# EAGLE schematic IOB-Adapter-Generic (EAGLE 7.7.0)
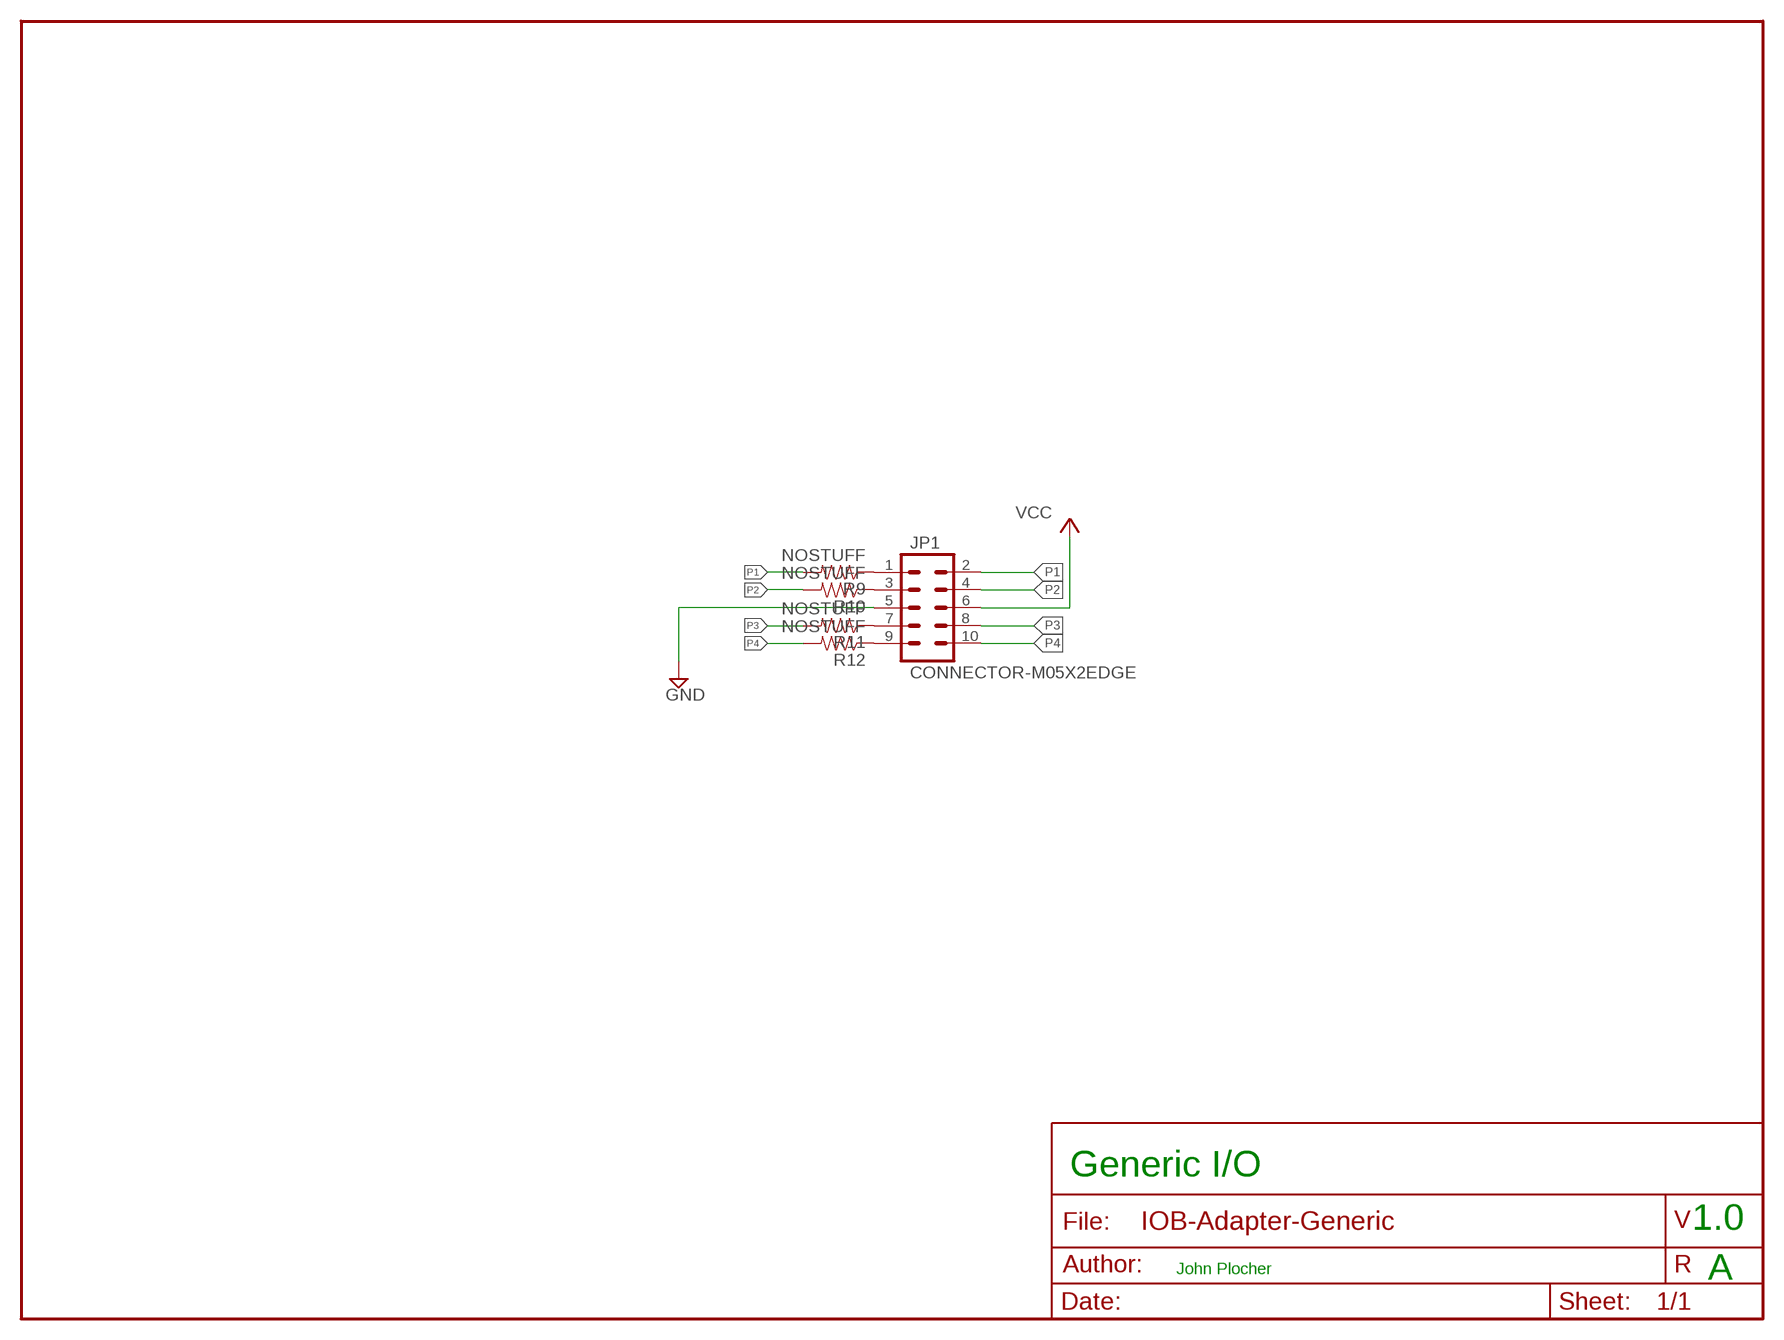
[diagram p0: schematic, sheet 1]

## Parts
JP1  CONNECTOR-M05X2EDGE  [2X5-EDGE]
R9  NOSTUFF  RPTH-R0  [CUT-R]
R10  NOSTUFF  RPTH-R0  [CUT-R]
R11  NOSTUFF  RPTH-R0  [CUT-R]
R12  NOSTUFF  RPTH-R0  [CUT-R]

## Nets
GND [Power]: JP1.5
N$1: JP1.1 R9.P2
N$2: JP1.3 R10.P2
N$3: JP1.7 R11.P2
N$4: JP1.9 R12.P2
P1 [signals]: JP1.2 R9.P1
P2 [signals]: JP1.4 R10.P1
P3 [signals]: JP1.8 R11.P1
P4 [signals]: JP1.10 R12.P1
VCC [Power]: JP1.6

## Notes on the sheet
- Generic I/O
- 1.0
- John Plocher
- A

## Library data of the parts
JP1 = SPCoast:CONNECTOR-M05X2: Header 5x2 Standard 10-pin dual row 0.1" header. Commonly used with AVR-ISP. Use with Spark Fun Electronics SKU: PRT-00778
R9-R12 = SPCoast:R*: Resistor Basic schematic elements and footprints for 0603, 1206, and PTH 1/10th watt (small) resistors.

## Net classes
0 default: width 0.254 mm, drill 0.4 mm, clearance 0.127 mm
1 Power: width 0.254 mm, drill 0.4 mm, clearance 0.127 mm
2 signals: width 0.254 mm, drill 0.4 mm, clearance 0.127 mm